# Altium schematic sheet adio.SCHDOC
size B
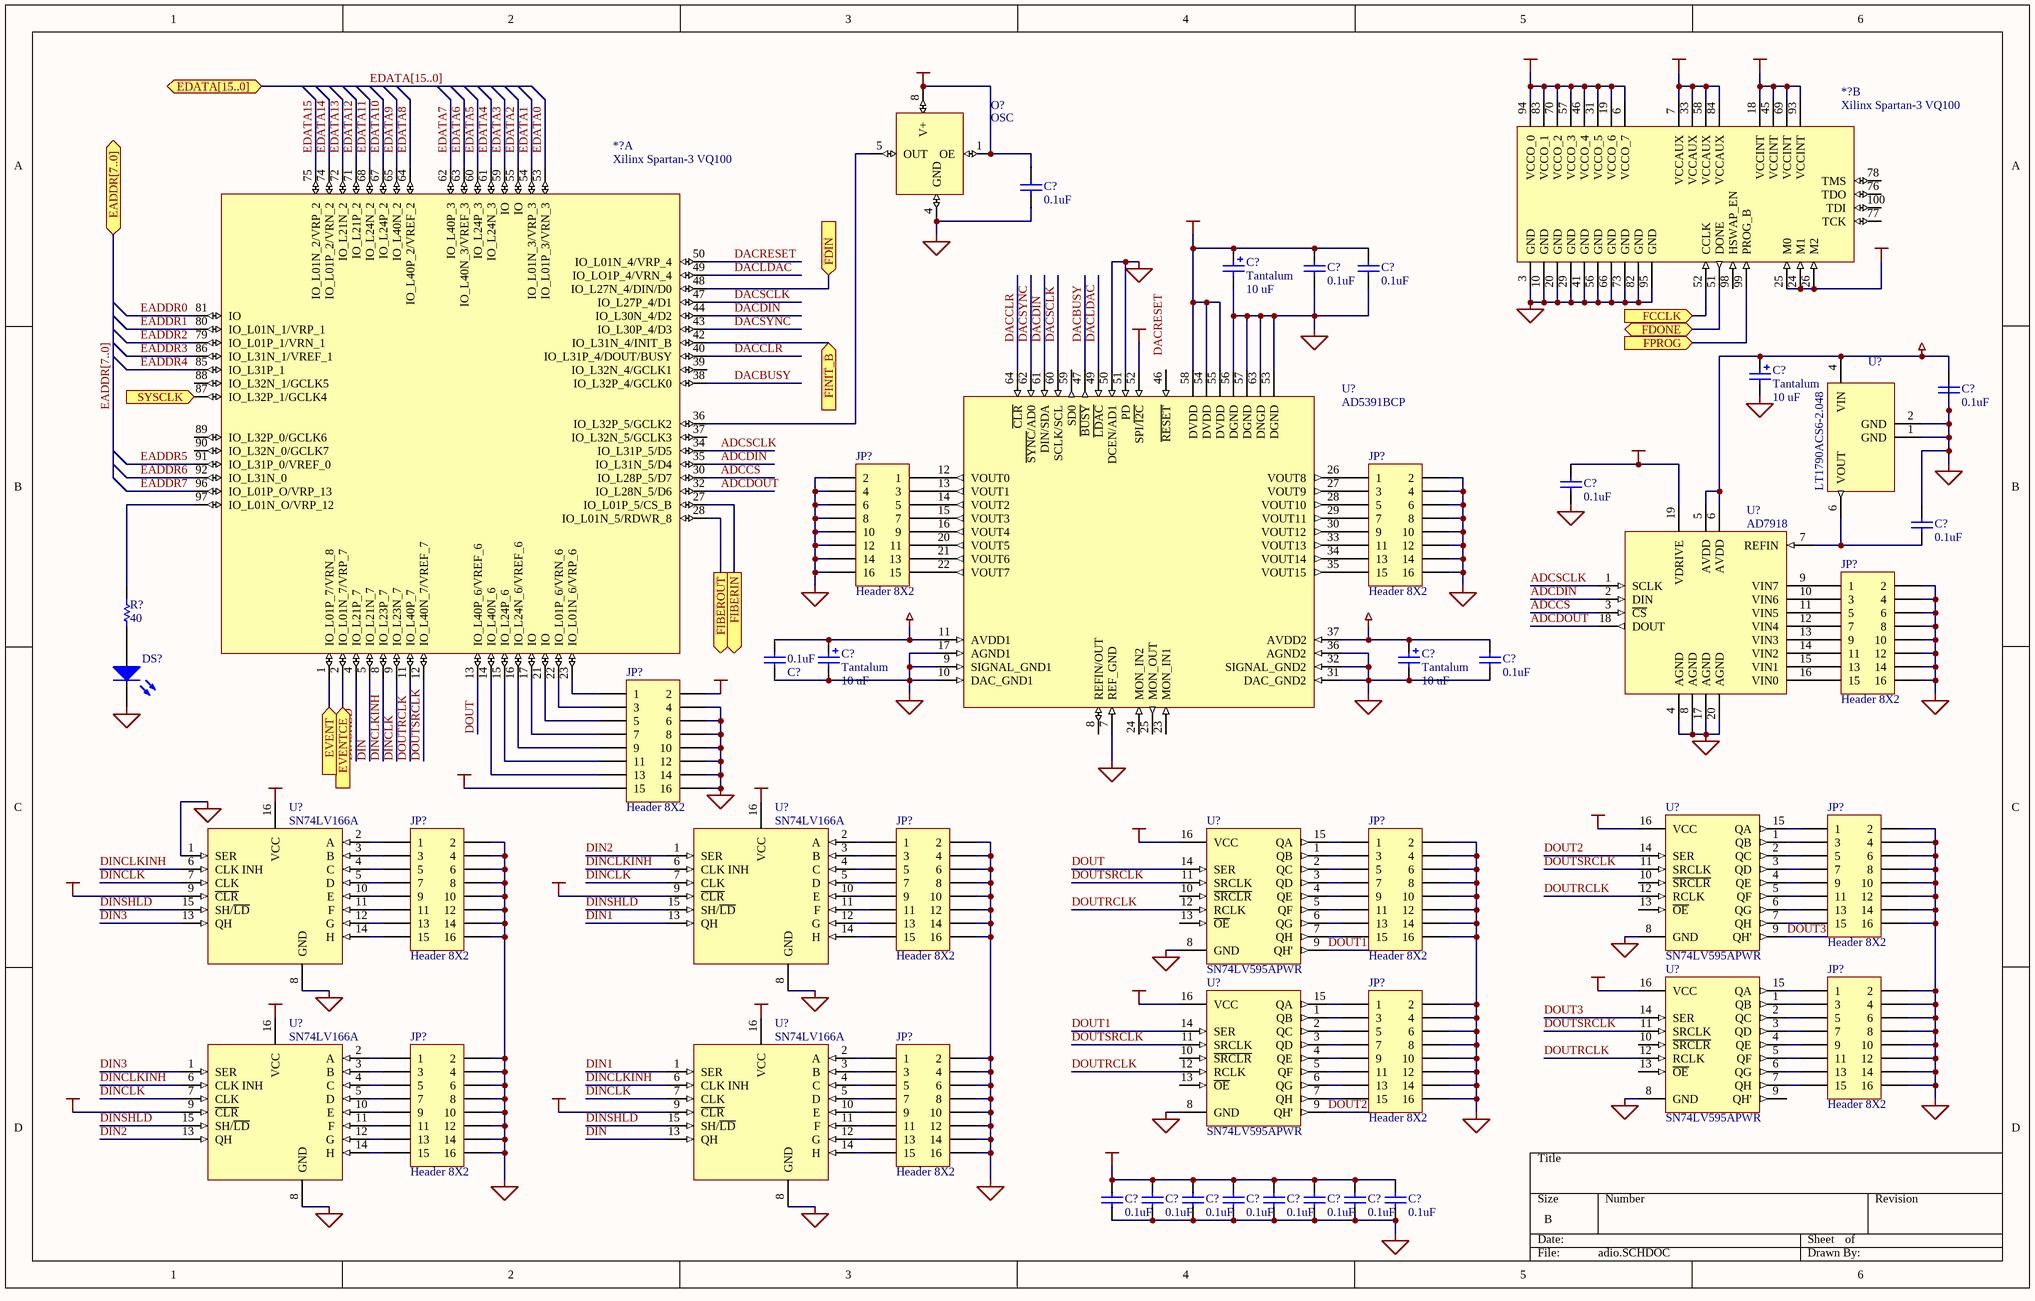
[diagram p0: adio.SCHDOC]

## Parts
(Parts that share a designator on the sheet are numbered #1, #2 ... from top to bottom, then left to right.)
*?#1  Xilinx Spartan-3 VQ100  [F-QFP14X14-G100/N]  (part B of 2)
*?#2  Xilinx Spartan-3 VQ100  [F-QFP14X14-G100/N]  (part A of 2)
C?#1  value 0.1uF  [CC1608-0603]  (hidden comment: Cap)
C?#2  Tantalum  value 10 uF  [TC7360-2924]
C?#3  value 0.1uF  [CC1608-0603]  (hidden comment: Cap)
C?#4  value 0.1uF  [CC1608-0603]  (hidden comment: Cap)
C?#5  Tantalum  value 10 uF  [TC7360-2924]
C?#6  value 0.1uF  [CC1608-0603]  (hidden comment: Cap)
C?#7  value 0.1uF  [CC1608-0603]  (hidden comment: Cap)
C?#8  value 0.1uF  [CC1608-0603]  (hidden comment: Cap)
C?#9  Tantalum  value 10 uF  [TC7360-2924]
C?#10  Tantalum  value 10 uF  [TC7360-2924]
C?#11  value 0.1uF  [CC1608-0603]  (hidden comment: Cap)
C?#12  value 0.1uF  [CC1608-0603]  (hidden comment: Cap)
C?#13  value 0.1uF  [CC1608-0603]  (hidden comment: Cap)
C?#14  value 0.1uF  [CC1608-0603]  (hidden comment: Cap)
C?#15  value 0.1uF  [CC1608-0603]  (hidden comment: Cap)
C?#16  value 0.1uF  [CC1608-0603]  (hidden comment: Cap)
C?#17  value 0.1uF  [CC1608-0603]  (hidden comment: Cap)
C?#18  value 0.1uF  [CC1608-0603]  (hidden comment: Cap)
C?#19  value 0.1uF  [CC1608-0603]  (hidden comment: Cap)
C?#20  value 0.1uF  [CC1608-0603]  (hidden comment: Cap)
DS?  LED0  [T-1_LED]  (value not drawn)
JP?#1  Header 8X2  [HDR2X8]
JP?#2  Header 8X2  [HDR2X8]
JP?#3  Header 8X2  [HDR2X8]
JP?#4  Header 8X2  [HDR2X8]
JP?#5  Header 8X2  [HDR2X8]
JP?#6  Header 8X2  [HDR2X8]
JP?#7  Header 8X2  [HDR2X8]
JP?#8  Header 8X2  [HDR2X8]
JP?#9  Header 8X2  [HDR2X8]
JP?#10  Header 8X2  [HDR2X8]
JP?#11  Header 8X2  [HDR2X8]
JP?#12  Header 8X2  [HDR2X8]
O?  OSC  [SG636PCE]
R?  value 40  [CC1608-0603]  (hidden comment: Res1)
U?#1  LT1790ACS6-2.048  [LTI SOT-23 ThinSOT]
U?#2  AD7918  [TSSO6x6-G20/Y1.6]
U?#3  AD5391BCP  [LFCSP-48]
U?#4  SN74LV166A  [SSO-G16/X.4]
U?#5  SN74LV166A  [SSO-G16/X.4]
U?#6  SN74LV595APWR  [SSO-G16/X.4]
U?#7  SN74LV595APWR  [SSO-G16/X.4]
U?#8  SN74LV595APWR  [SSO-G16/X.4]
U?#9  SN74LV595APWR  [SSO-G16/X.4]
U?#10  SN74LV166A  [SSO-G16/X.4]
U?#11  SN74LV166A  [SSO-G16/X.4]

## Ports
EADDR[7..0] (bidir), EDATA[15..0] (bidir), EVENT (in), EVENTCE (in), FCCLK (in), FDIN (in), FDONE (bidir), FIBERIN (out), FIBEROUT (out), FINIT_B (in), FPROG (in), SYSCLK (in)

## Nets
+1.2VCC: *?#1.18(VCCINT) *?#1.45(VCCINT) *?#1.69(VCCINT) *?#1.93(VCCINT)
+2.5VCC: *?#1.7(VCCAUX) *?#1.33(VCCAUX) *?#1.58(VCCAUX) *?#1.84(VCCAUX)
+3.3VCC: *?#1.6(VCCO_7) *?#1.19(VCCO_6) *?#1.31(VCCO_5) *?#1.46(VCCO_4) *?#1.57(VCCO_3) *?#1.70(VCCO_2) *?#1.83(VCCO_1) *?#1.94(VCCO_0)
+5VCC: C?#13.2 C?#14.2 C?#15.2 C?#16.2 C?#17.2 C?#18.2 C?#19.2 C?#20.2 JP?#4.15 U?#4.9(~{CLR}) U?#4.16(VCC) U?#5.9(~{CLR}) U?#5.16(VCC) U?#6.16(VCC) U?#7.16(VCC) U?#8.16(VCC) U?#9.16(VCC) U?#10.9(~{CLR}) U?#10.16(VCC) U?#11.9(~{CLR}) U?#11.16(VCC)
AVDD: C?#5.1 C?#6.2 C?#9.1 C?#10.1 C?#11.2 C?#12.2 U?#1.4(VIN) U?#2.5(AVDD) U?#2.6(AVDD) U?#3.11(AVDD1) U?#3.37(AVDD2)
GND: *?#1.3(GND) *?#1.10(GND) *?#1.20(GND) *?#1.29(GND) *?#1.41(GND) *?#1.56(GND) *?#1.66(GND) *?#1.73(GND) *?#1.82(GND) *?#1.95(GND) C?#1.2 C?#2.2 C?#3.2 C?#4.1 C?#5.2 C?#6.1 C?#7.1 C?#8.2 C?#9.2 C?#10.2 C?#11.1 C?#12.1 C?#13.1 C?#14.1 C?#15.1 C?#16.1 C?#17.1 C?#18.1 C?#19.1 C?#20.1 DS?.2(K) JP?#1.2 JP?#1.4 JP?#1.6 JP?#1.8 JP?#1.10 JP?#1.12 JP?#1.14 JP?#1.16 JP?#2.2 JP?#2.4 JP?#2.6 JP?#2.8 JP?#2.10 JP?#2.12 JP?#2.14 JP?#2.16 JP?#3.2 JP?#3.4 JP?#3.6 JP?#3.8 JP?#3.10 JP?#3.12 JP?#3.14 JP?#3.16 JP?#4.4 JP?#4.6 JP?#4.8 JP?#4.10 JP?#4.12 JP?#4.14 JP?#4.16 JP?#5.2 JP?#5.4 JP?#5.6 JP?#5.8 JP?#5.10 JP?#5.12 JP?#5.14 JP?#5.16 JP?#6.2 JP?#6.4 JP?#6.6 JP?#6.8 JP?#6.10 JP?#6.12 JP?#6.14 JP?#6.16 JP?#7.2 JP?#7.4 JP?#7.6 JP?#7.8 JP?#7.10 JP?#7.12 JP?#7.14 JP?#7.16 JP?#8.2 JP?#8.4 JP?#8.6 JP?#8.8 JP?#8.10 JP?#8.12 JP?#8.14 JP?#8.16 JP?#9.2 JP?#9.4 JP?#9.6 JP?#9.8 JP?#9.10 JP?#9.12 JP?#9.14 JP?#9.16 JP?#10.2 JP?#10.4 JP?#10.6 JP?#10.8 JP?#10.10 JP?#10.12 JP?#10.14 JP?#10.16 JP?#11.2 JP?#11.4 JP?#11.6 JP?#11.8 JP?#11.10 JP?#11.12 JP?#11.14 JP?#11.16 JP?#12.2 JP?#12.4 JP?#12.6 JP?#12.8 JP?#12.10 JP?#12.12 JP?#12.14 JP?#12.16 O?.4(GND) U?#1.1(GND) U?#1.2(GND) U?#2.4(AGND) U?#2.8(AGND) U?#2.17(AGND) U?#2.20(AGND) U?#3.7(REF_GND) U?#3.9(SIGNAL_GND1) U?#3.10(DAC_GND1) U?#3.17(AGND1) U?#3.31(DAC_GND2) U?#3.32(SIGNAL_GND2) U?#3.36(AGND2) U?#3.50(DCEN/AD1) U?#3.51(PD) U?#3.53(DGND) U?#3.56(DGND) U?#3.57(DGND) U?#3.63(DNGD) U?#4.1(SER) U?#4.8(GND) U?#5.8(GND) U?#6.8(GND) U?#7.8(GND) U?#8.8(GND) U?#9.8(GND) U?#10.8(GND) U?#11.8(GND)
VCC: *?#1.24(M1) *?#1.25(M0) *?#1.26(M2) C?#1.1 C?#2.1 C?#3.1 C?#4.2 C?#7.2 JP?#4.2 O?.1(OE) O?.8(V+) U?#2.19(VDRIVE) U?#3.52(SPI/~{I2C}) U?#3.54(DVDD) U?#3.55(DVDD) U?#3.58(DVDD)
ADCCS: *?#2.30(IO_L28P_5/D7) U?#2.3(~{CS})
ADCDIN: *?#2.35(IO_L31N_5/D4) U?#2.2(DIN)
ADCDOUT: *?#2.32(IO_L28N_5/D6) U?#2.18(DOUT)
ADCSCLK: *?#2.34(IO_L31P_5/D5) U?#2.1(SCLK)
DACBUSY: *?#2.38(IO_L32P_4/GCLK0) U?#3.47(~{BUSY})
DACCLR: *?#2.40(IO_L31P_4/DOUT/BUSY) U?#3.64(~{CLR})
DACDIN: *?#2.44(IO_L30N_4/D2) U?#3.61(DIN/SDA)
DACLDAC: *?#2.49(IO_LO1P_4/VRN_4) U?#3.49(~{LDAC})
DACRESET: *?#2.50(IO_L01N_4/VRP_4)
DACSCLK: *?#2.47(IO_L27P_4/D1) U?#3.60(SCLK/SCL)
DACSYNC: *?#2.43(IO_L30P_4/D3) U?#3.62(~{SYNC}/AD0)
DIN: *?#2.5(IO_L21N_7) U?#11.13(QH)
DIN1: U?#5.13(QH) U?#11.1(SER)
DIN2: U?#5.1(SER) U?#10.13(QH)
DIN3: U?#4.13(QH) U?#10.1(SER)
DINCLK: *?#2.9(IO_L23N_7) U?#4.7(CLK) U?#5.7(CLK) U?#10.7(CLK) U?#11.7(CLK)
DINCLKINH: *?#2.8(IO_L23P_7) U?#4.6(CLK_INH) U?#5.6(CLK_INH) U?#10.6(CLK_INH) U?#11.6(CLK_INH)
DINSHLD: *?#2.4(IO_L21P_7) U?#4.15(SH/~{LD}) U?#5.15(SH/~{LD}) U?#10.15(SH/~{LD}) U?#11.15(SH/~{LD})
DOUT: *?#2.13(IO_L40P_6/VREF_6) U?#7.14(SER)
DOUT1: U?#7.9(QH') U?#9.14(SER)
DOUT2: U?#6.14(SER) U?#9.9(QH')
DOUT3: U?#6.9(QH') U?#8.14(SER)
DOUTRCLK: *?#2.11(IO_L40P_7) U?#6.12(RCLK) U?#7.12(RCLK) U?#8.12(RCLK) U?#9.12(RCLK)
DOUTSRCLK: *?#2.12(IO_L40N_7/VREF_7) U?#6.11(SRCLK) U?#7.11(SRCLK) U?#8.11(SRCLK) U?#9.11(SRCLK)
EADDR0: *?#2.81(IO)
EADDR1: *?#2.80(IO_L01N_1/VRP_1)
EADDR2: *?#2.79(IO_L01P_1/VRN_1)
EADDR3: *?#2.86(IO_L31N_1/VREF_1)
EADDR4: *?#2.85(IO_L31P_1)
EADDR5: *?#2.91(IO_L31P_0/VREF_0)
EADDR6: *?#2.92(IO_L31N_0)
EADDR7: *?#2.96(IO_L01P_O/VRP_13)
EDATA0: *?#2.53(IO_L01P_3/VRN_3)
EDATA1: *?#2.54(IO_L01N_3/VRP_3)
EDATA2: *?#2.55(IO)
EDATA3: *?#2.59(IO)
EDATA4: *?#2.61(IO_L24N_3)
EDATA5: *?#2.60(IO_L24P_3)
EDATA6: *?#2.63(IO_L40N_3/VREF_3)
EDATA7: *?#2.62(IO_L40P_3)
EDATA8: *?#2.64(IO_L40P_2/VREF_2)
EDATA9: *?#2.65(IO_L40N_2)
EDATA10: *?#2.67(IO_L24P_2)
EDATA11: *?#2.68(IO_L24N_2)
EDATA12: *?#2.71(IO_L21P_2)
EDATA13: *?#2.72(IO_L21N_2)
EDATA14: *?#2.74(IO_L01P_2/VRN_2)
EDATA15: *?#2.75(IO_L01N_2/VRP_2)
EVENT: *?#2.1(IO_L01P_7/VRN_8) ; port EVENT
EVENTCE: *?#2.2(IO_L01N_7/VRP_7) ; port EVENTCE
FCCLK: *?#1.52(CCLK) ; port FCCLK
FDIN: *?#2.48(IO_L27N_4/DIN/D0) ; port FDIN
FDONE: *?#1.51(DONE) ; port FDONE
FIBERIN: *?#2.27(IO_L01P_5/CS_B) ; port FIBERIN
FIBEROUT: *?#2.28(IO_L01N_5/RDWR_8) ; port FIBEROUT
FINIT_B: *?#2.42(IO_L31N_4/INIT_B) ; port FINIT_B
FPROG: *?#1.99(PROG_B) ; port FPROG
SYSCLK: *?#2.87(IO_L32P_1/GCLK4) ; port SYSCLK
Net*?#2_14: *?#2.14(IO_L40N_6) JP?#4.13
Net*?#2_15: *?#2.15(IO_L24P_6) JP?#4.11
Net*?#2_16: *?#2.16(IO_L24N_6/VREF_6) JP?#4.9
Net*?#2_17: *?#2.17(IO) JP?#4.7
Net*?#2_21: *?#2.21(IO) JP?#4.5
Net*?#2_22: *?#2.22(IO_L01P_6/VRN_6) JP?#4.3
Net*?#2_23: *?#2.23(IO_L01N_6/VRP_6) JP?#4.1
Net*?#2_36: *?#2.36(IO_L32P_5/GCLK2) O?.5(OUT)
Net*?#2_97: *?#2.97(IO_L01N_O/VRP_12) R?.2
NetC?#8_1: C?#8.1 U?#1.6(VOUT) U?#2.7(REFIN)
NetDS?_1: DS?.1(A) R?.1
NetJP?#1_1: JP?#1.1 U?#3.12(VOUT0)
NetJP?#1_3: JP?#1.3 U?#3.13(VOUT1)
NetJP?#1_5: JP?#1.5 U?#3.14(VOUT2)
NetJP?#1_7: JP?#1.7 U?#3.15(VOUT3)
NetJP?#1_9: JP?#1.9 U?#3.16(VOUT4)
NetJP?#1_11: JP?#1.11 U?#3.20(VOUT5)
NetJP?#1_13: JP?#1.13 U?#3.21(VOUT6)
NetJP?#1_15: JP?#1.15 U?#3.22(VOUT7)
NetJP?#2_1: JP?#2.1 U?#3.26(VOUT8)
NetJP?#2_3: JP?#2.3 U?#3.27(VOUT9)
NetJP?#2_5: JP?#2.5 U?#3.28(VOUT10)
NetJP?#2_7: JP?#2.7 U?#3.29(VOUT11)
NetJP?#2_9: JP?#2.9 U?#3.30(VOUT12)
NetJP?#2_11: JP?#2.11 U?#3.33(VOUT13)
NetJP?#2_13: JP?#2.13 U?#3.34(VOUT14)
NetJP?#2_15: JP?#2.15 U?#3.35(VOUT15)
NetJP?#3_1: JP?#3.1 U?#2.9(VIN7)
NetJP?#3_3: JP?#3.3 U?#2.10(VIN6)
NetJP?#3_5: JP?#3.5 U?#2.11(VIN5)
NetJP?#3_7: JP?#3.7 U?#2.12(VIN4)
NetJP?#3_9: JP?#3.9 U?#2.13(VIN3)
NetJP?#3_11: JP?#3.11 U?#2.14(VIN2)
NetJP?#3_13: JP?#3.13 U?#2.15(VIN1)
NetJP?#3_15: JP?#3.15 U?#2.16(VIN0)
NetJP?#5_1: JP?#5.1 U?#6.15(QA)
NetJP?#5_3: JP?#5.3 U?#6.1(QB)
NetJP?#5_5: JP?#5.5 U?#6.2(QC)
NetJP?#5_7: JP?#5.7 U?#6.3(QD)
NetJP?#5_9: JP?#5.9 U?#6.4(QE)
NetJP?#5_11: JP?#5.11 U?#6.5(QF)
NetJP?#5_13: JP?#5.13 U?#6.6(QG)
NetJP?#5_15: JP?#5.15 U?#6.7(QH)
NetJP?#6_1: JP?#6.1 U?#4.2(A)
NetJP?#6_3: JP?#6.3 U?#4.3(B)
NetJP?#6_5: JP?#6.5 U?#4.4(C)
NetJP?#6_7: JP?#6.7 U?#4.5(D)
NetJP?#6_9: JP?#6.9 U?#4.10(E)
NetJP?#6_11: JP?#6.11 U?#4.11(F)
NetJP?#6_13: JP?#6.13 U?#4.12(G)
NetJP?#6_15: JP?#6.15 U?#4.14(H)
NetJP?#7_1: JP?#7.1 U?#5.2(A)
NetJP?#7_3: JP?#7.3 U?#5.3(B)
NetJP?#7_5: JP?#7.5 U?#5.4(C)
NetJP?#7_7: JP?#7.7 U?#5.5(D)
NetJP?#7_9: JP?#7.9 U?#5.10(E)
NetJP?#7_11: JP?#7.11 U?#5.11(F)
NetJP?#7_13: JP?#7.13 U?#5.12(G)
NetJP?#7_15: JP?#7.15 U?#5.14(H)
NetJP?#8_1: JP?#8.1 U?#7.15(QA)
NetJP?#8_3: JP?#8.3 U?#7.1(QB)
NetJP?#8_5: JP?#8.5 U?#7.2(QC)
NetJP?#8_7: JP?#8.7 U?#7.3(QD)
NetJP?#8_9: JP?#8.9 U?#7.4(QE)
NetJP?#8_11: JP?#8.11 U?#7.5(QF)
NetJP?#8_13: JP?#8.13 U?#7.6(QG)
NetJP?#8_15: JP?#8.15 U?#7.7(QH)
NetJP?#9_1: JP?#9.1 U?#8.15(QA)
NetJP?#9_3: JP?#9.3 U?#8.1(QB)
NetJP?#9_5: JP?#9.5 U?#8.2(QC)
NetJP?#9_7: JP?#9.7 U?#8.3(QD)
NetJP?#9_9: JP?#9.9 U?#8.4(QE)
NetJP?#9_11: JP?#9.11 U?#8.5(QF)
NetJP?#9_13: JP?#9.13 U?#8.6(QG)
NetJP?#9_15: JP?#9.15 U?#8.7(QH)
NetJP?#10_1: JP?#10.1 U?#9.15(QA)
NetJP?#10_3: JP?#10.3 U?#9.1(QB)
NetJP?#10_5: JP?#10.5 U?#9.2(QC)
NetJP?#10_7: JP?#10.7 U?#9.3(QD)
NetJP?#10_9: JP?#10.9 U?#9.4(QE)
NetJP?#10_11: JP?#10.11 U?#9.5(QF)
NetJP?#10_13: JP?#10.13 U?#9.6(QG)
NetJP?#10_15: JP?#10.15 U?#9.7(QH)
NetJP?#11_1: JP?#11.1 U?#10.2(A)
NetJP?#11_3: JP?#11.3 U?#10.3(B)
NetJP?#11_5: JP?#11.5 U?#10.4(C)
NetJP?#11_7: JP?#11.7 U?#10.5(D)
NetJP?#11_9: JP?#11.9 U?#10.10(E)
NetJP?#11_11: JP?#11.11 U?#10.11(F)
NetJP?#11_13: JP?#11.13 U?#10.12(G)
NetJP?#11_15: JP?#11.15 U?#10.14(H)
NetJP?#12_1: JP?#12.1 U?#11.2(A)
NetJP?#12_3: JP?#12.3 U?#11.3(B)
NetJP?#12_5: JP?#12.5 U?#11.4(C)
NetJP?#12_7: JP?#12.7 U?#11.5(D)
NetJP?#12_9: JP?#12.9 U?#11.10(E)
NetJP?#12_11: JP?#12.11 U?#11.11(F)
NetJP?#12_13: JP?#12.13 U?#11.12(G)
NetJP?#12_15: JP?#12.15 U?#11.14(H)

Not connected (* = marked no-connect by the designer): *?#1 76(TDO) 77(TCK) 78(TMS) 98(HSWAP_EN) 100(TDI); *?#2 37(IO_L32N_5/GCLK3) 39(IO_L32N_4/GCLK1) 88(IO_L32N_1/GCLK5) 89(IO_L32P_0/GCLK6) 90(IO_L32N_0/GCLK7); U?#3 8(REFIN/OUT) 23(MON_IN1) 24(MON_IN2) 25(MON_OUT) 46(~{RESET}) 59(SD0); U?#6 10(~{SRCLR}) 13(~{OE}); U?#7 10(~{SRCLR}) 13(~{OE}); U?#8 9(QH') 10(~{SRCLR}) 13(~{OE}); U?#9 10(~{SRCLR}) 13(~{OE})

## Buses and harness runs
bus EADDR[7..0] = port EADDR[7..0]
bus EDATA[15..0] = port EDATA[15..0]

## Notes on the sheet
- Labels drawn without touching a wire or pin: DACRESET

## Library data of the parts
*?#1 *?#2 = XC3S50-VQ100
C?#1 C?#3 C?#4 C?#6-C?#8 C?#11-C?#20 = Cap: Capacitor; Manufacturer: Generic Components; Class I: Passive; Published: 8-Jun-2000; Revision: July-2002: Re-released for DXP Platform.; Publisher: Altium Limited; Class II: Capacitor
C?#2 C?#5 C?#9 C?#10 = Cap Pol1: Polarized Capacitor (Radial); Manufacturer: Generic Components; Class I: Passive; Published: 8-Jun-2000; Revision: July-2002: Re-released for DXP Platform.; Publisher: Altium Limited; Class II: Capacitor
DS? = LED0: Typical INFRARED GaAs LED; Manufacturer: Generic Components; Class I: Optoelectronic; Published: 8-Jun-2000; Revision: July-2002: Re-released for DXP Platform.; Publisher: Altium Limited; Class II: LED
JP?#1-JP?#12 = Header 8X2: Header, 8-Pin, Dual row; Manufacturer: Generic Components; Class I: Connector; Revision: July-2002: Re-released for DXP Platform.; Publisher: Altium Limited
O? = OSC: Epson CMOS/TTL Oscillator
R? = Res1: Resistor; Manufacturer: Generic Components; Class I: Passive; Published: 8-Jun-2000; Revision: July-2002: Re-released for DXP Platform.; Publisher: Altium Limited; Class II: Resistor
U?#1 = LT1790
U?#2 = AD7918: AD 8-channel 1 MSPS 10-bit ADC
U?#3 = AD5391BCP: 12-bit 16-channel 5V Single-supply DAC with serial interface
U?#4 U?#5 U?#10 U?#11 = SN74LV166APWR: 8-bit parallel-load shift register
U?#6-U?#9 = SN74LV595APWR: 8-bit shift register with 3-state output